# EAGLE design Schaltplan_Power_Amp (EAGLE 7.5.0)
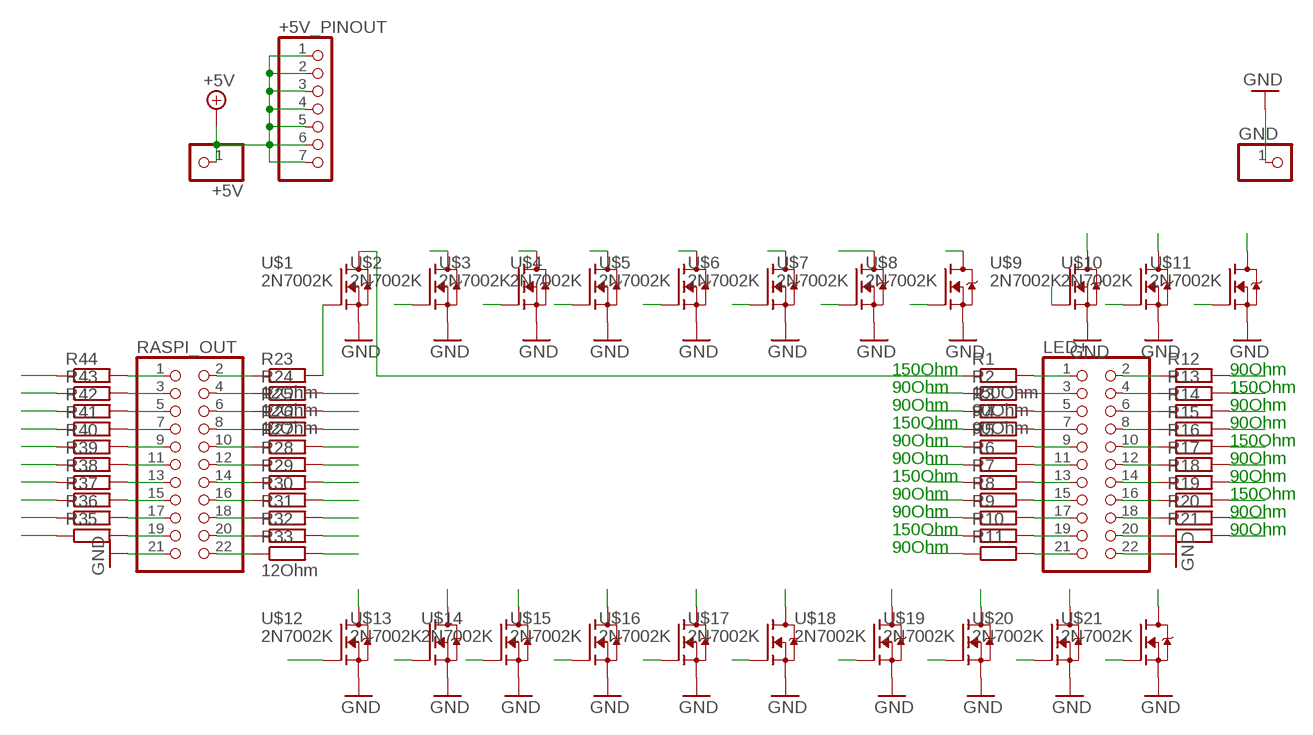
[diagram p0: schematic, sheet 1]

## Parts
+5V  PINHD-1X1  [1X01]
+5V_PINOUT  PINHD-1X7  [1X07]
GND  PINHD-1X1  [1X01]
LED+  PINHD-2X11  [2X11]
R1  150Ohm  R-EU_M1206  [M1206]
R2  90Ohm  R-EU_M1206  [M1206]
R3  90Ohm  R-EU_M1206  [M1206]
R4  R-EU_M1206  [M1206]
R5  R-EU_M1206  [M1206]
R6  R-EU_M1206  [M1206]
R7  R-EU_M1206  [M1206]
R8  R-EU_M1206  [M1206]
R9  R-EU_M1206  [M1206]
R10  R-EU_M1206  [M1206]
R11  R-EU_M1206  [M1206]
R12  R-EU_M1206  [M1206]
R13  R-EU_M1206  [M1206]
R14  R-EU_M1206  [M1206]
R15  R-EU_M1206  [M1206]
R16  R-EU_M1206  [M1206]
R17  R-EU_M1206  [M1206]
R18  R-EU_M1206  [M1206]
R19  R-EU_M1206  [M1206]
R20  R-EU_M1206  [M1206]
R21  R-EU_M1206  [M1206]
R23  12Ohm  R-EU_M1206  [M1206]
R24  12Ohm  R-EU_M1206  [M1206]
R25  12Ohm  R-EU_M1206  [M1206]
R26  R-EU_M1206  [M1206]
R27  R-EU_M1206  [M1206]
R28  R-EU_M1206  [M1206]
R29  R-EU_M1206  [M1206]
R30  R-EU_M1206  [M1206]
R31  R-EU_M1206  [M1206]
R32  R-EU_M1206  [M1206]
R33  12Ohm  R-EU_M1206  [M1206]
R35  R-EU_M1206  [M1206]
R36  R-EU_M1206  [M1206]
R37  R-EU_M1206  [M1206]
R38  R-EU_M1206  [M1206]
R39  R-EU_M1206  [M1206]
R40  R-EU_M1206  [M1206]
R41  R-EU_M1206  [M1206]
R42  R-EU_M1206  [M1206]
R43  R-EU_M1206  [M1206]
R44  R-EU_M1206  [M1206]
RASPI_OUT  PINHD-2X11  [2X11]
U$1  2N7002K  [SOT23]
U$2  2N7002K  [SOT23]
U$3  2N7002K  [SOT23]
U$4  2N7002K  [SOT23]
U$5  2N7002K  [SOT23]
U$6  2N7002K  [SOT23]
U$7  2N7002K  [SOT23]
U$8  2N7002K  [SOT23]
U$9  2N7002K  [SOT23]
U$10  2N7002K  [SOT23]
U$11  2N7002K  [SOT23]
U$12  2N7002K  [SOT23]
U$13  2N7002K  [SOT23]
U$14  2N7002K  [SOT23]
U$15  2N7002K  [SOT23]
U$16  2N7002K  [SOT23]
U$17  2N7002K  [SOT23]
U$18  2N7002K  [SOT23]
U$19  2N7002K  [SOT23]
U$20  2N7002K  [SOT23]
U$21  2N7002K  [SOT23]

## Nets
+5V: +5V.1 +5V_PINOUT.1 +5V_PINOUT.2 +5V_PINOUT.3 +5V_PINOUT.4 +5V_PINOUT.5 +5V_PINOUT.6 +5V_PINOUT.7
DRAIN2: R2.1 U$2.3(D)
DRAIN3: R3.1 U$3.3(D)
DRAIN4: R4.1 U$4.3(D)
DRAIN5: R5.1 U$5.3(D)
DRAIN6: R6.1 U$6.3(D)
DRAIN7: R7.1 U$7.3(D)
DRAIN8: R8.1 U$8.3(D)
DRAIN9: R9.1 U$9.3(D)
DRAIN10: R10.1 U$10.3(D)
DRAIN11: R11.1 U$11.3(D)
DRAIN12: R12.2 U$12.3(D)
DRAIN13: R13.2 U$13.3(D)
DRAIN14: R14.2 U$14.3(D)
DRAIN15: R15.2 U$15.3(D)
DRAIN16: R16.2 U$16.3(D)
DRAIN17: R17.2 U$17.3(D)
DRAIN18: R18.2 U$18.3(D)
DRAIN19: R19.2 U$19.3(D)
DRAIN20: R20.2 U$20.3(D)
DRAIN21: R21.2 U$21.3(D)
GATE2: R24.2 U$2.1(G)
GATE3: R25.2 U$3.1(G)
GATE4: R26.2 U$4.1(G)
GATE5: R27.2 U$5.1(G)
GATE6: R28.2 U$6.1(G)
GATE7: R29.2 U$7.1(G)
GATE8: R30.2 U$8.1(G)
GATE9: R31.2 U$9.1(G)
GATE10: R32.2 U$10.1(G)
GATE11: R33.2 U$11.1(G)
GATE12: R44.1 U$12.1(G)
GATE13: R43.1 U$13.1(G)
GATE14: R42.1 U$14.1(G)
GATE15: R41.1 U$15.1(G)
GATE16: R40.1 U$16.1(G)
GATE17: R39.1 U$17.1(G)
GATE18: R38.1 U$18.1(G)
GATE19: R37.1 U$19.1(G)
GATE20: R36.1 U$20.1(G)
GATE21: R35.1 U$21.1(G)
GND: GND.1 LED+.22 RASPI_OUT.21 U$1.2(S) U$2.2(S) U$3.2(S) U$4.2(S) U$5.2(S) U$6.2(S) U$7.2(S) U$8.2(S) U$9.2(S) U$10.2(S) U$11.2(S) U$12.2(S) U$13.2(S) U$14.2(S) U$15.2(S) U$16.2(S) U$17.2(S) U$18.2(S) U$19.2(S) U$20.2(S) U$21.2(S)
N$1: R44.2 RASPI_OUT.1
N$2: R43.2 RASPI_OUT.3
N$3: R42.2 RASPI_OUT.5
N$4: R41.2 RASPI_OUT.7
N$5: R40.2 RASPI_OUT.9
N$6: R39.2 RASPI_OUT.11
N$7: R38.2 RASPI_OUT.13
N$8: R37.2 RASPI_OUT.15
N$9: R36.2 RASPI_OUT.17
N$10: R35.2 RASPI_OUT.19
N$12: R23.1 RASPI_OUT.2
N$13: R24.1 RASPI_OUT.4
N$14: R25.1 RASPI_OUT.6
N$15: R26.1 RASPI_OUT.8
N$16: R27.1 RASPI_OUT.10
N$17: R28.1 RASPI_OUT.12
N$18: R29.1 RASPI_OUT.14
N$19: R30.1 RASPI_OUT.16
N$20: R31.1 RASPI_OUT.18
N$21: R32.1 RASPI_OUT.20
N$22: R33.1 RASPI_OUT.22
N$23: LED+.1 R1.2
N$24: LED+.3 R2.2
N$25: LED+.5 R3.2
N$26: LED+.7 R4.2
N$27: LED+.9 R5.2
N$28: LED+.11 R6.2
N$29: LED+.13 R7.2
N$30: LED+.15 R8.2
N$31: LED+.17 R9.2
N$32: LED+.19 R10.2
N$33: LED+.21 R11.2
N$34: LED+.2 R12.1
N$35: LED+.4 R13.1
N$36: LED+.6 R14.1
N$37: LED+.8 R15.1
N$38: LED+.10 R16.1
N$39: LED+.12 R17.1
N$40: LED+.14 R18.1
N$41: LED+.16 R19.1
N$42: LED+.18 R20.1
N$43: LED+.20 R21.1
N$45: R23.2 U$1.1(G)
N$46: R1.1 U$1.3(D)

## Notes on the sheet
- 150Ohm | 90Ohm
- 90Ohm | 150Ohm
- 90Ohm | 90Ohm
- 150Ohm | 90Ohm
- 90Ohm | 150Ohm
- 90Ohm | 90Ohm
- 150Ohm | 90Ohm
- 90Ohm | 150Ohm
- 90Ohm | 90Ohm
- 150Ohm | 90Ohm
- 90Ohm

## Library data of the parts
+5V GND = pinhead:PINHD-1X1: PIN HEADER
+5V_PINOUT = pinhead:PINHD-1X7: PIN HEADER
LED+ RASPI_OUT = pinhead:PINHD-2X11: PIN HEADER
R1-R21 R23-R33 R35-R44 = rcl:R-EU_: RESISTOR, European symbol
U$1-U$21 = transistor-fet:2N7002K: N Channel Mosfet

## Net classes
0 default: width 0.45 mm, drill 0.08 mm, clearance 0.15 mm
1 alt: width 0.2 mm, drill 0.08 mm, clearance 0.2 mm

## Board
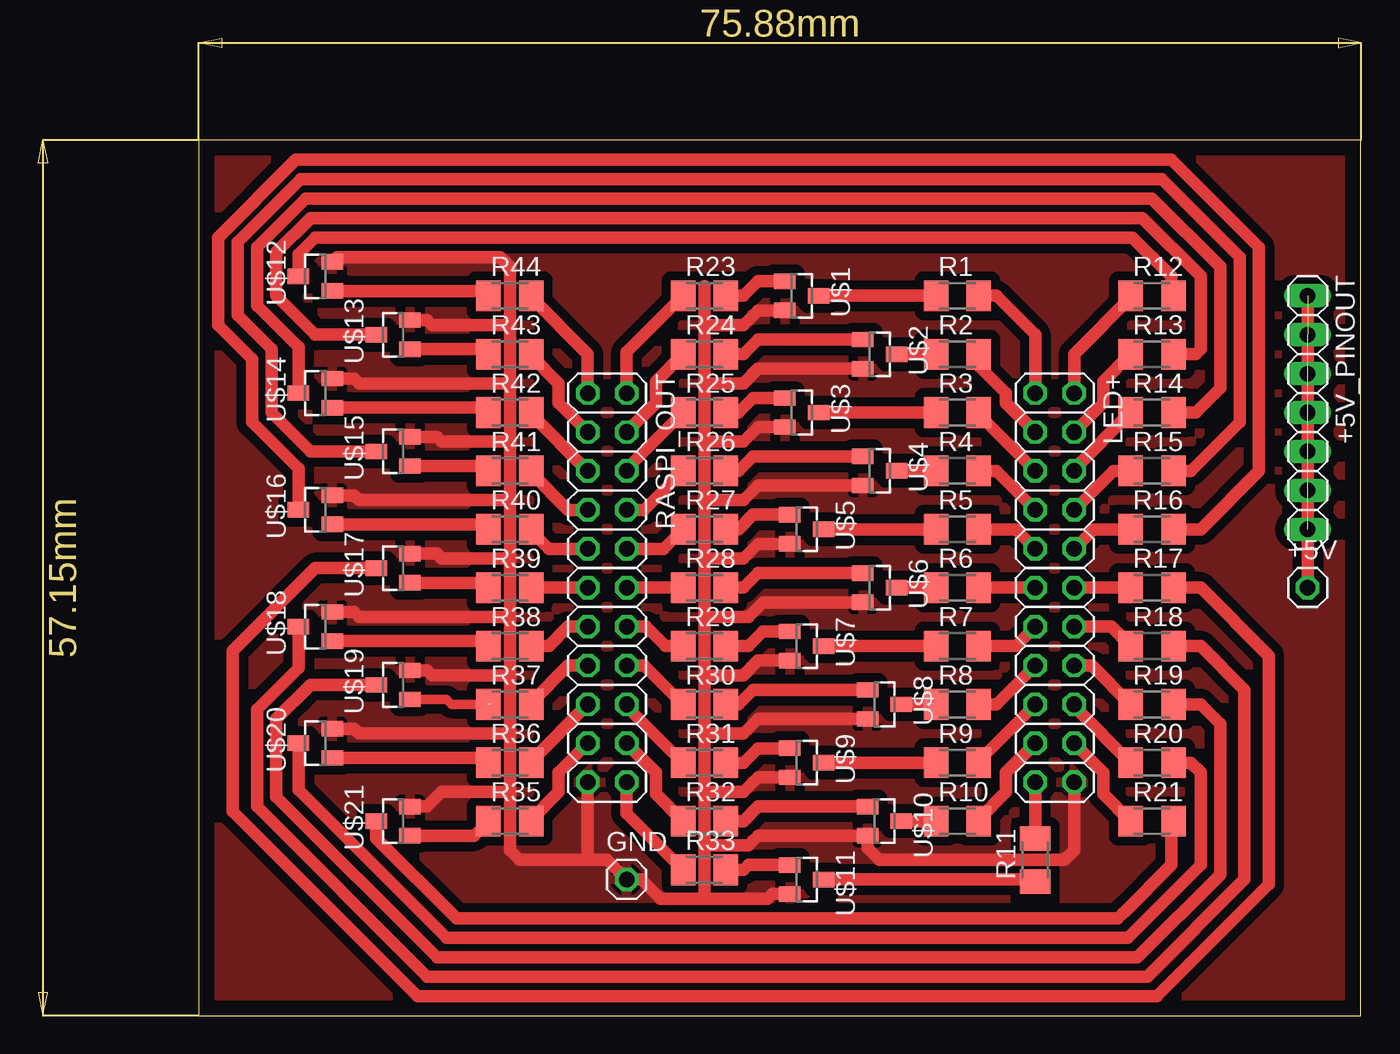
[diagram p1: board, top side]

Size 75.87 x 57.14 mm. Coordinates in mm from the lower left corner, seen from the top.
Outline: 0,0 75.87,0 75.87,57.14 0,57.14 0,0
Copper layers (1*16): Top 0.035mm / dielectric 1.5mm / Bottom 0.035mm
Design rules "default": minimum track width 10mil, minimum drill 24mil, track to track 8mil, track to pad 8mil, pad to pad 8mil, via to via 8mil, smd to smd 8mil, copper to edge 40mil, drill to drill 8mil, minimum pad ring 10mil, minimum via ring 8mil, stop-mask expansion 4mil, vias tented up to drill 0mil, thermal gap 10mil

### Footprints (pad centres in the part's own frame; a part is rotated, then mirrored left to right if it is on the bottom)
1X01 = drill 1.016 octagon: 1 0,0
1X07 = drill 1.016 long: 1 -7.62,0; 2 -5.08,0; 3 -2.54,0; 4 0,0; 5 2.54,0; 6 5.08,0; 7 7.62,0
2X11 = drill 1.016 octagon: 1 -12.7,-1.27; 2 -12.7,1.27; 3 -10.16,-1.27; 4 -10.16,1.27; 5 -7.62,-1.27; 6 -7.62,1.27; 7 -5.08,-1.27; 8 -5.08,1.27; 9 -2.54,-1.27; 10 -2.54,1.27; 11 0,-1.27; 12 0,1.27; 13 2.54,-1.27; 14 2.54,1.27; 15 5.08,-1.27; 16 5.08,1.27; 17 7.62,-1.27; 18 7.62,1.27; 19 10.16,-1.27; 20 10.16,1.27; 21 12.7,-1.27; 22 12.7,1.27
M1206 = smd 1.6 x 2: 1 -1.4,0; 2 1.4,0
SOT23 = smd 1 x 1.4: 1 -0.95,-1.1; 2 0.95,-1.1; 3 0,1.1

### Placement (x,y rotation side)
+5V  72.39,27.94 0 top
+5V_PINOUT  72.39,39.37 270 top
GND  27.94,8.89 0 top
LED+  55.88,27.94 270 top
R1  49.53,46.99 0 top
R2  49.53,43.18 0 top
R3  49.53,39.37 0 top
R4  49.53,35.56 0 top
R5  49.53,31.75 0 top
R6  49.53,27.94 0 top
R7  49.53,24.13 0 top
R8  49.53,20.32 0 top
R9  49.53,16.51 0 top
R10  49.53,12.7 0 top
R11  54.61,10.16 90 top
R12  62.23,46.99 0 top
R13  62.23,43.18 0 top
R14  62.23,39.37 0 top
R15  62.23,35.56 0 top
R16  62.23,31.75 0 top
R17  62.23,27.94 0 top
R18  62.23,24.13 0 top
R19  62.23,20.32 0 top
R20  62.23,16.51 0 top
R21  62.23,12.7 0 top
R23  33.02,46.99 0 top
R24  33.02,43.18 0 top
R25  33.02,39.37 0 top
R26  33.02,35.56 0 top
R27  33.02,31.75 0 top
R28  33.02,27.94 0 top
R29  33.02,24.13 0 top
R30  33.02,20.32 0 top
R31  33.02,16.51 0 top
R32  33.02,12.7 0 top
R33  33.02,9.53 0 top
R35  20.32,12.7 0 top
R36  20.32,16.51 0 top
R37  20.32,20.32 0 top
R38  20.32,24.13 0 top
R39  20.32,27.94 0 top
R40  20.32,31.75 0 top
R41  20.32,35.56 0 top
R42  20.32,39.37 0 top
R43  20.32,43.18 0 top
R44  20.32,46.99 0 top
RASPI_OUT  26.67,27.94 270 top
U$1  39.37,46.99 270 top
U$2  44.45,43.18 270 top
U$3  39.37,39.37 270 top
U$4  44.45,35.56 270 top
U$5  39.69,31.75 270 top
U$6  44.45,27.94 270 top
U$7  39.69,24.13 270 top
U$8  44.77,20.32 270 top
U$9  39.69,16.51 270 top
U$10  44.77,12.7 270 top
U$11  39.69,8.89 270 top
U$12  7.62,48.26 90 top
U$13  12.7,44.45 90 top
U$14  7.62,40.64 90 top
U$15  12.7,36.83 90 top
U$16  7.62,33.02 90 top
U$17  12.7,29.21 90 top
U$18  7.62,25.4 90 top
U$19  12.7,21.59 90 top
U$20  7.62,17.78 90 top
U$21  12.7,12.7 90 top

### Tracks (layer width: path | path; a pad name or v marks a point on that pad's centre or on a via)
+5V  (6 unrouted)
  Top 0.813: +5V_PINOUT.1 +5V.1
DRAIN2
  Top 0.813: U$2.3 R2.1
DRAIN3
  Top 0.813: U$3.3 R3.1
DRAIN4
  Top 0.813: U$4.3 R4.1
DRAIN5
  Top 0.813: U$5.3 R5.1
DRAIN6
  Top 0.813: U$6.3 R6.1
DRAIN7
  Top 0.813: U$7.3 R7.1
DRAIN8
  Top 0.813: U$8.3 R8.1
DRAIN9
  Top 0.813: U$9.3 R9.1
DRAIN10
  Top 0.813: U$10.3 R10.1
DRAIN11
  Top 0.813: U$11.3 54.48,8.89 R11.1
DRAIN12
  Top 0.813: U$12.3 6.52,49.7 7.62,50.8 60.96,50.8 63.5,48.26 63.5,47.12 R12.2
DRAIN13
  Top 0.813: U$13.3 7.62,44.45 5.08,46.99 5.08,49.85 7.3,52.07 61.59,52.07 65.41,48.26 65.41,43.5 65.09,43.18 R13.2
DRAIN14
  Top 0.813: U$14.3 6.52,43.65 3.81,46.35 3.81,50.16 6.99,53.34 62.23,53.34 66.67,48.9 66.67,40.96 65.09,39.37 R14.2
DRAIN15
  Top 0.813: U$15.3 7.3,36.83 4.76,39.37 4.76,43.5 2.54,45.72 2.54,50.48 6.67,54.61 62.87,54.61 67.94,49.53 67.94,38.73 64.77,35.56 R15.2
DRAIN16
  Top 0.813: U$16.3 6.52,35.71 3.49,38.73 3.49,42.86 1.27,45.09 1.27,50.8 6.35,55.88 63.5,55.88 69.22,50.16 69.22,35.56 65.41,31.75 R16.2
DRAIN17
  Top 0.813: U$17.3 7.62,29.21 2.22,23.81 2.22,13.34 14.29,1.27 62.55,1.27 69.85,8.57 69.85,23.5 65.41,27.94 R17.2
DRAIN18
  Top 0.813: U$18.3 6.52,22.71 3.81,20 3.81,13.65 14.92,2.54 61.91,2.54 68.26,8.89 68.26,21.27 65.41,24.13 R18.2
DRAIN19
  Top 0.813: U$19.3 7.3,21.59 5.08,19.37 5.08,14.29 15.56,3.81 61.28,3.81 66.67,9.21 66.67,19.05 65.41,20.32 R19.2
DRAIN20
  Top 0.813: U$20.3 6.52,14.75 16.19,5.08 60.64,5.08 65.41,9.84 65.41,15.88 64.77,16.51 R20.2
DRAIN21
  Top 0.813: U$21.3 11.6,11.58 16.83,6.35 60.01,6.35 60.33,6.67 60.48,6.83 63.5,9.84 63.5,12.57 R21.2
GATE2
  Top 0.813: R24.2 35.56,43.18 36.51,44.13 U$2.1
GATE3
  Top 0.813: R25.2 35.24,39.37 36.2,40.32 U$3.1
GATE4
  Top 0.813: R26.2 35.24,35.56 36.2,36.51 U$4.1
GATE5
  Top 0.813: R27.2 35.24,31.75 36.2,32.7 U$5.1
GATE6
  Top 0.813: R28.2 35.56,27.94 36.51,28.89 U$6.1
GATE7
  Top 0.813: R29.2 35.88,24.13 36.83,25.08 U$7.1
GATE8
  Top 0.813: R30.2 35.24,20.32 36.2,21.27 U$8.1
GATE9
  Top 0.813: R31.2 35.56,16.51 36.51,17.46 U$9.1
GATE10
  Top 0.813: R32.2 35.56,12.7 36.51,13.65 U$10.1
GATE11
  Top 0.813: R33.2 35.56,9.53 35.88,9.84 U$11.1
GATE12
  Top 0.813: U$12.1 18.6,47.31 R44.1
GATE13
  Top 0.813: U$13.1 18.6,43.5 R43.1
GATE14
  Top 0.813: U$14.1 18.73,39.69 19.05,39.37 R42.1
GATE15
  Top 0.813: U$15.1 18.6,35.88 R41.1
GATE16
  Top 0.813: U$16.1 18.6,32.07 R40.1
GATE17
  Top 0.813: U$17.1 18.6,28.26 R39.1
GATE18
  Top 0.813: U$18.1 18.6,24.45 R38.1
GATE19  (1 unrouted)
  Top 0.61: U$19.1 16.19,20.64 16.51,20.32 19.05,20.32
GATE20
  Top 0.813: U$20.1 18.6,16.83 R36.1
GATE21
  Top 0.813: U$21.1 17.97,11.75 R35.1
GND
  Top 0.813: 25.4,10.16 26.67,10.16 GND.1 28.89,8.89 30.16,7.62 32.7,7.62 | 25.4,10.16 20.95,10.16 20.32,10.79 20.32,14.61 | 20.32,14.61 20.32,18.41 | 20.32,18.41 20.32,22.23 | 20.32,22.23 20.32,25.72 | 20.32,25.72 20.32,30.16 | 20.32,30.16 20.32,33.66 | 20.32,33.66 20.32,37.47 | 20.32,37.47 20.32,41.27 | 20.32,41.27 20.32,45.09 | 20.32,45.09 20.32,48.9 19.68,49.53 9.04,49.53 U$12.2 | U$13.2 14.93,45.4 15.24,45.09 20.32,45.09 | U$14.2 10.16,41.59 10.48,41.27 20.32,41.27 | U$15.2 15.56,37.78 15.88,37.47 20.32,37.47 | U$16.2 10.16,33.97 10.48,33.66 20.32,33.66 | U$17.2 15.56,30.16 15.88,29.84 20,29.84 20.32,30.16 | U$18.2 10.16,26.35 10.48,26.04 20,26.04 20.32,25.72 | U$19.2 14.93,22.54 15.24,22.23 20.32,22.23 | U$20.2 9.21,18.73 10.16,18.73 10.48,18.41 20.32,18.41 | U$21.2 14.92,13.65 15.88,14.61 20.32,14.61 | 33.02,11.11 33.02,7.94 32.7,7.62 | 33.02,11.11 33.02,14.61 | 33.02,14.61 33.02,18.41 | 33.02,18.41 33.02,21.91 | 33.02,21.91 33.02,25.72 | 33.02,25.72 33.02,29.84 | 33.02,29.84 33.02,33.66 | 33.02,33.66 33.02,37.47 | 33.02,37.47 33.02,41.27 | 33.02,41.27 33.02,45.09 | 33.02,45.09 33.02,47.62 | U$1.2 36.52,46.04 35.56,45.09 33.02,45.09 | U$2.2 36.52,42.23 35.56,41.27 33.02,41.27 | U$3.2 36.52,38.42 35.56,37.47 33.02,37.47 | U$4.2 36.52,34.61 35.56,33.66 33.02,33.66 | U$5.2 36.52,30.8 35.56,29.84 33.02,29.84 | U$6.2 36.83,26.99 35.88,26.04 33.34,26.04 33.02,25.72 | U$7.2 36.52,23.18 35.56,22.23 33.34,22.23 33.02,21.91 | U$8.2 36.52,19.37 35.56,18.41 33.02,18.41 | U$9.2 36.52,15.56 35.56,14.61 33.02,14.61 | U$11.2 37.47,7.94 37.15,7.62 32.7,7.62 | 33.02,11.11 35.88,11.11 36.52,11.75 U$10.2 43.67,10.94 44.45,10.16 56.52,10.16 57.15,10.79 LED+.22
  Top 0.813: RASPI_OUT.21 25.4,10.16
  pour Top (isolate 0.61): 0,0 75.56,0 75.56,56.83 75.56,57.15 0,57.15
N$1
  Top 0.813: R44.2 21.72,46.86 25.4,43.18 RASPI_OUT.1
N$2
  Top 0.813: R43.2 21.72,43.05 23.5,41.27 23.5,40.01 RASPI_OUT.3
N$3
  Top 0.813: R42.2 21.72,39.24 RASPI_OUT.5
N$4
  Top 0.813: R41.2 21.72,35.43 24.13,33.02 RASPI_OUT.7
N$5
  Top 0.813: R40.2 21.72,31.62 22.86,30.48 RASPI_OUT.9
N$6
  Top 0.813: R39.2 RASPI_OUT.11
N$7
  Top 0.813: R38.2 22.86,24.13 24.13,25.4 RASPI_OUT.13
N$8
  Top 0.813: R37.2 21.72,20.45 24.13,22.86 RASPI_OUT.15
N$9
  Top 0.813: R36.2 21.72,16.64 RASPI_OUT.17
N$10
  Top 0.813: R35.2 21.72,12.83 23.5,14.61 23.5,15.88 RASPI_OUT.19
N$12
  Top 0.813: RASPI_OUT.2 27.94,43.31 R23.1
N$13
  Top 0.813: RASPI_OUT.4 29.84,40.01 29.84,41.41 R24.1
N$14
  Top 0.813: RASPI_OUT.6 27.94,35.69 R25.1
N$15
  Top 0.813: RASPI_OUT.8 29.08,33.02 R26.1
N$16
  Top 0.813: RASPI_OUT.10 30.35,30.48 R27.1
N$17
  Top 0.813: RASPI_OUT.12 R28.1
N$18
  Top 0.813: RASPI_OUT.14 29.21,25.4 30.48,24.13 R29.1
N$19
  Top 0.813: RASPI_OUT.16 29.08,22.86 R30.1
N$20
  Top 0.813: RASPI_OUT.18 27.94,20.19 R31.1
N$21
  Top 0.813: RASPI_OUT.20 29.84,15.88 29.84,14.47 R32.1
N$22
  Top 0.813: RASPI_OUT.22 27.94,13.21 R33.1
N$23
  Top 0.813: R1.2 52.07,46.99 54.61,44.45 LED+.1
N$24
  Top 0.813: R2.2 50.93,42.41 52.7,40.64 52.7,40.01 LED+.3
N$25
  Top 0.813: R3.2 50.93,39.24 LED+.5
N$26
  Top 0.813: R4.2 52.07,35.56 LED+.7
N$27
  Top 0.813: R5.2 53.34,31.75 LED+.9
N$28
  Top 0.813: R6.2 LED+.11
N$29
  Top 0.813: R7.2 53.34,24.13 LED+.13
N$30
  Top 0.813: R8.2 52.07,20.32 LED+.15
N$31
  Top 0.813: R9.2 50.93,16.64 LED+.17
N$32
  Top 0.813: R10.2 50.93,12.83 52.7,14.61 52.7,15.88 LED+.19
N$33
  Top 0.813: R11.2 LED+.21
N$34
  Top 0.813: LED+.2 57.15,43.18 60.96,46.99 R12.1
N$35
  Top 0.813: LED+.4 59.05,40.01 59.05,41.41 R13.1
N$36
  Top 0.813: LED+.6 57.15,35.69 R14.1
N$37
  Top 0.813: R15.1 59.69,35.56 LED+.8
N$38
  Top 0.813: R16.1 58.42,31.75 LED+.10
N$39
  Top 0.813: LED+.12 R17.1
N$40
  Top 0.813: LED+.14 59.56,25.4 R18.1
N$41
  Top 0.813: LED+.16 58.29,22.86 R19.1
N$42
  Top 0.813: LED+.18 57.15,20.19 R20.1
N$43
  Top 0.813: LED+.20 59.05,15.88 59.05,14.47 R21.1
N$45
  Top 0.813: R23.2 35.56,46.99 36.51,47.94 U$1.1
N$46
  Top 0.813: U$1.3 R1.1